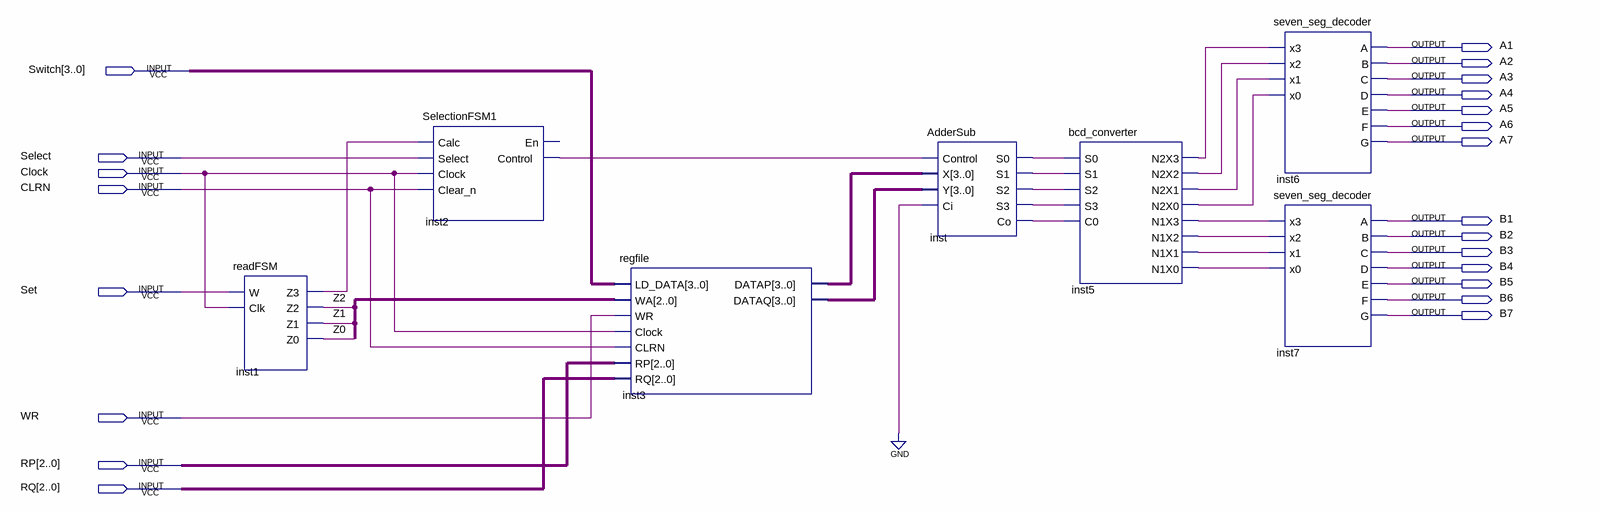
[diagram p0: schematic sheet]
// Quartus schematic FinalProject.bdf as structural Verilog: 7 symbols, 22 pins
module FinalProject (
  input  [3:0] Switch,
  input  Select,
  input  Clock,
  input  CLRN,
  input  Set,
  input  WR,
  input  [2:0] RP,
  input  [2:0] RQ,
  output A1,
  output A2,
  output A3,
  output A4,
  output A5,
  output A6,
  output A7,
  output B1,
  output B2,
  output B3,
  output B4,
  output B5,
  output B6,
  output B7
);

  wire inst1_z3, inst2_control, inst5_n1x0, inst5_n1x1, inst5_n1x2, inst5_n1x3, inst5_n2x0, inst5_n2x1,
       inst5_n2x2, inst5_n2x3, inst_co, inst_s0, inst_s1, inst_s2, inst_s3, Z0, Z1, Z2;
  wire [2:0] undriven;
  wire [3:0] inst3_datap, inst3_dataq;

  readFSM inst1 (.W(Set), .Clk(Clock), .Z3(inst1_z3), .Z2(Z2), .Z1(Z1), .Z0(Z0));
  SelectionFSM1 inst2 (
    .Calc(inst1_z3), .Select(Select), .Clock(Clock), .Clear_n(CLRN), .Control(inst2_control));  // open: En
  regfile inst3 (
    .LD_DATA(Switch), .WA(undriven), .WR(WR), .Clock(Clock), .CLRN(CLRN), .RP(RP), .RQ(RQ),
    .DATAP(inst3_datap), .DATAQ(inst3_dataq));
  AdderSub inst (
    .Control(inst2_control), .X(inst3_datap), .Y(inst3_dataq), .Ci(1'b0), .S0(inst_s0), .S1(inst_s1),
    .S2(inst_s2), .S3(inst_s3), .Co(inst_co));
  bcd_converter inst5 (
    .S0(inst_s0), .S1(inst_s1), .S2(inst_s2), .S3(inst_s3), .C0(inst_co), .N2X3(inst5_n2x3),
    .N2X2(inst5_n2x2), .N2X1(inst5_n2x1), .N2X0(inst5_n2x0), .N1X3(inst5_n1x3), .N1X2(inst5_n1x2),
    .N1X1(inst5_n1x1), .N1X0(inst5_n1x0));
  seven_seg_decoder inst6 (
    .x3(inst5_n2x3), .x2(inst5_n2x2), .x1(inst5_n2x1), .x0(inst5_n2x0), .A(A1), .B(A2), .C(A3), .D(A4),
    .E(A5), .F(A6), .G(A7));
  seven_seg_decoder inst7 (
    .x3(inst5_n1x3), .x2(inst5_n1x2), .x1(inst5_n1x1), .x0(inst5_n1x0), .A(B1), .B(B2), .C(B3), .D(B4),
    .E(B5), .F(B6), .G(B7));
endmodule
